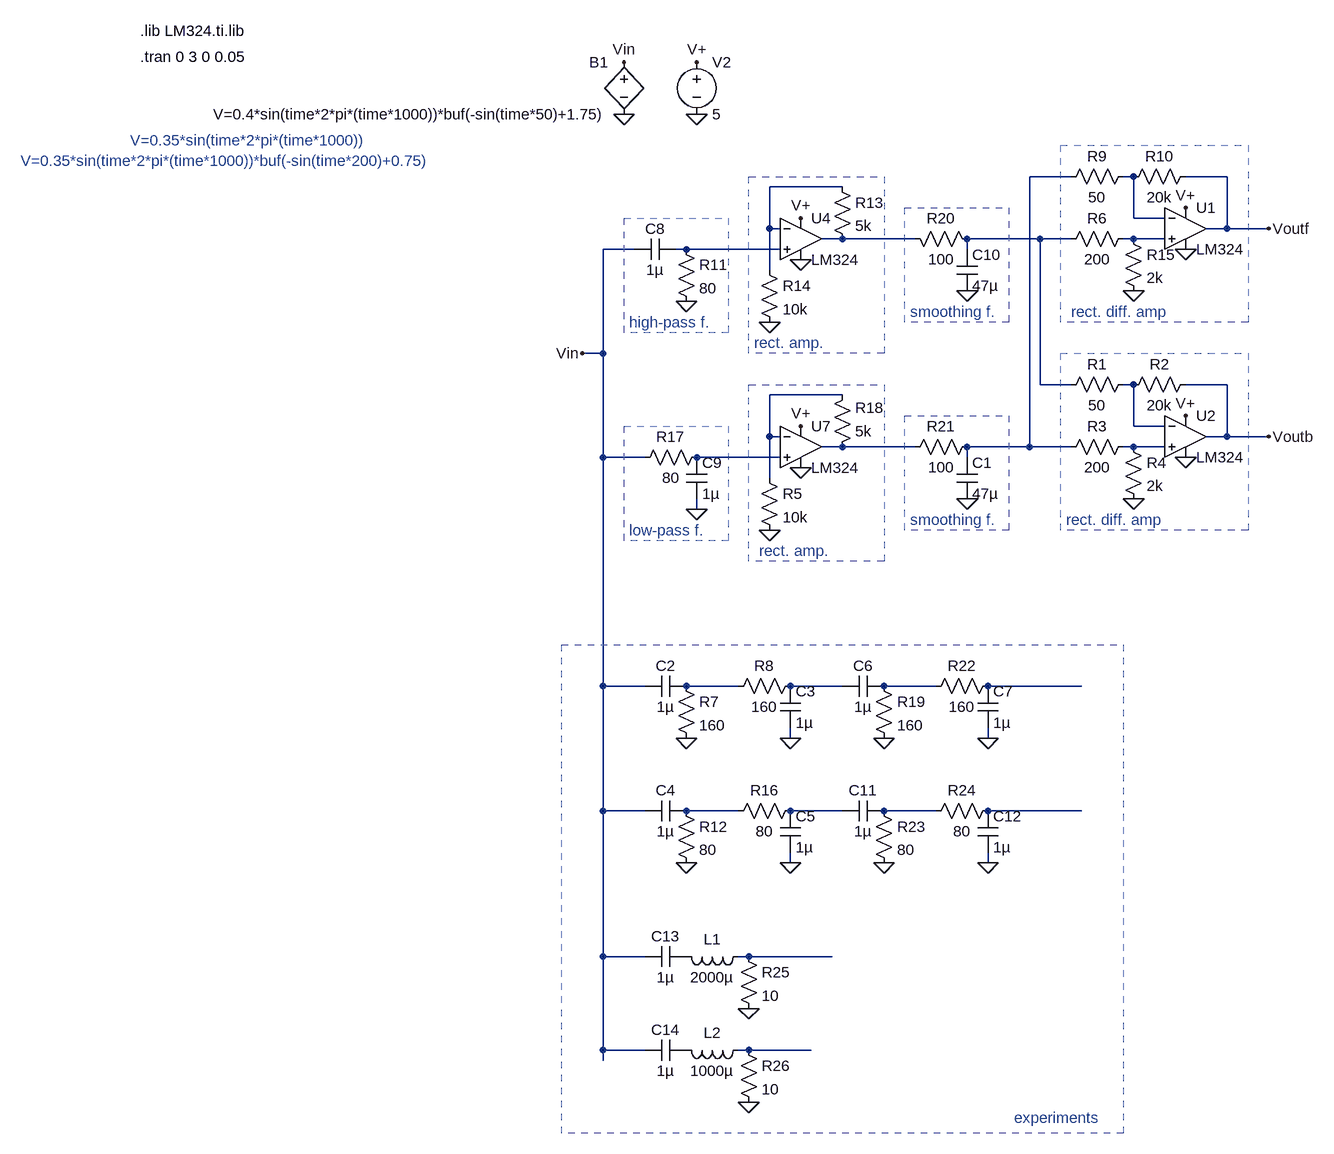
[diagram p0: schematic circuit.asc]
circuit.asc, the LTspice schematic file:
Version 4
SHEET 1 1988 1492
WIRE 352 -48 288 -48
WIRE 448 -48 432 -48
WIRE 592 -48 528 -48
WIRE 0 -32 -112 -32
WIRE 448 16 448 -48
WIRE 496 16 448 16
WIRE -112 32 -112 -32
WIRE -96 32 -112 32
WIRE 592 32 592 -48
WIRE 592 32 560 32
WIRE 656 32 592 32
WIRE 0 48 -32 48
WIRE 112 48 0 48
WIRE 304 48 192 48
WIRE 352 48 304 48
WIRE 448 48 432 48
WIRE 496 48 448 48
WIRE -320 64 -368 64
WIRE -240 64 -256 64
WIRE -96 64 -240 64
WIRE 192 64 192 48
WIRE -112 96 -112 32
WIRE -368 224 -368 64
WIRE -368 224 -400 224
WIRE 304 272 304 48
WIRE 352 272 304 272
WIRE 448 272 432 272
WIRE 592 272 528 272
WIRE 0 288 -112 288
WIRE 448 336 448 272
WIRE 496 336 448 336
WIRE -112 352 -112 288
WIRE -96 352 -112 352
WIRE 592 352 592 272
WIRE 592 352 560 352
WIRE 656 352 592 352
WIRE 0 368 -32 368
WIRE 112 368 0 368
WIRE 288 368 288 -48
WIRE 288 368 192 368
WIRE 352 368 288 368
WIRE 448 368 432 368
WIRE 496 368 448 368
WIRE -368 384 -368 224
WIRE -304 384 -368 384
WIRE -96 384 -224 384
WIRE 192 384 192 368
WIRE -112 416 -112 352
WIRE -224 464 -224 448
WIRE -368 736 -368 384
WIRE -304 736 -368 736
WIRE -160 736 -240 736
WIRE 0 736 -80 736
WIRE 144 736 64 736
WIRE 368 736 224 736
WIRE -80 816 -80 800
WIRE 224 816 224 800
WIRE -368 928 -368 736
WIRE -304 928 -368 928
WIRE -160 928 -240 928
WIRE 0 928 -80 928
WIRE 144 928 64 928
WIRE 368 928 224 928
WIRE -80 1008 -80 992
WIRE 224 1008 224 992
WIRE -368 1152 -368 928
WIRE -304 1152 -368 1152
WIRE -144 1152 -160 1152
WIRE -16 1152 -144 1152
WIRE -368 1296 -368 1152
WIRE -304 1296 -368 1296
WIRE -144 1296 -160 1296
WIRE -48 1296 -144 1296
WIRE -368 1312 -368 1296
FLAG -336 -144 0
FLAG -224 -144 0
FLAG -224 -224 V+
FLAG -240 144 0
FLAG -64 80 0
FLAG -112 176 0
FLAG -64 16 V+
FLAG -224 464 0
FLAG -64 400 0
FLAG -112 496 0
FLAG -64 336 V+
FLAG 192 128 0
FLAG 192 448 0
FLAG 528 64 0
FLAG 528 0 V+
FLAG 656 32 Voutf
FLAG 448 128 0
FLAG 528 384 0
FLAG 528 320 V+
FLAG 656 352 Voutb
FLAG 448 448 0
FLAG -336 -224 Vin
FLAG -400 224 Vin
FLAG -80 816 0
FLAG -240 816 0
FLAG -80 1008 0
FLAG -240 1008 0
FLAG 224 816 0
FLAG 64 816 0
FLAG 224 1008 0
FLAG 64 1008 0
FLAG -144 1232 0
FLAG -144 1376 0
SYMBOL voltage -224 -240 R0
WINDOW 123 0 0 Left 2
WINDOW 39 0 0 Left 2
SYMATTR InstName V2
SYMATTR Value 5
SYMBOL bv -336 -240 M0
SYMATTR InstName B1
SYMATTR Value V=0.4*sin(time*2*pi*(time*1000))*buf(-sin(time*50)+1.75)
SYMBOL res -256 48 R0
SYMATTR InstName R11
SYMATTR Value 80
SYMBOL Opamps\\opamp2 -64 -16 R0
SYMATTR InstName U4
SYMATTR Value LM324
SYMBOL res -16 -48 R0
SYMATTR InstName R13
SYMATTR Value 5k
SYMBOL res -128 80 R0
SYMATTR InstName R14
SYMATTR Value 10k
SYMBOL cap -256 48 R90
WINDOW 0 0 32 VBottom 2
WINDOW 3 32 32 VTop 2
SYMATTR InstName C8
SYMATTR Value 1µ
SYMBOL res -208 368 R90
WINDOW 0 0 56 VBottom 2
WINDOW 3 32 56 VTop 2
SYMATTR InstName R17
SYMATTR Value 80
SYMBOL Opamps\\opamp2 -64 304 R0
SYMATTR InstName U7
SYMATTR Value LM324
SYMBOL res -16 384 M180
WINDOW 0 36 76 Left 2
WINDOW 3 36 40 Left 2
SYMATTR InstName R18
SYMATTR Value 5k
SYMBOL cap -240 384 R0
SYMATTR InstName C9
SYMATTR Value 1µ
SYMBOL res 208 64 M270
WINDOW 0 32 56 VTop 2
WINDOW 3 0 56 VBottom 2
SYMATTR InstName R20
SYMATTR Value 100
SYMBOL cap 176 128 M180
WINDOW 0 24 56 Left 2
WINDOW 3 24 8 Left 2
SYMATTR InstName C10
SYMATTR Value 47µ
SYMBOL res 208 352 R90
WINDOW 0 0 56 VBottom 2
WINDOW 3 32 56 VTop 2
SYMATTR InstName R21
SYMATTR Value 100
SYMBOL res -128 400 R0
SYMATTR InstName R5
SYMATTR Value 10k
SYMBOL Opamps\\opamp2 528 -32 R0
SYMATTR InstName U1
SYMATTR Value LM324
SYMBOL res 448 -64 R90
WINDOW 0 0 56 VBottom 2
WINDOW 3 32 56 VTop 2
SYMATTR InstName R9
SYMATTR Value 50
SYMBOL res 544 -64 R90
WINDOW 0 0 56 VBottom 2
WINDOW 3 32 56 VTop 2
SYMATTR InstName R10
SYMATTR Value 20k
SYMBOL res 432 32 R0
SYMATTR InstName R15
SYMATTR Value 2k
SYMBOL Opamps\\opamp2 528 288 R0
SYMATTR InstName U2
SYMATTR Value LM324
SYMBOL res 448 256 R90
WINDOW 0 0 56 VBottom 2
WINDOW 3 32 56 VTop 2
SYMATTR InstName R1
SYMATTR Value 50
SYMBOL res 544 256 R90
WINDOW 0 0 56 VBottom 2
WINDOW 3 32 56 VTop 2
SYMATTR InstName R2
SYMATTR Value 20k
SYMBOL res 448 352 R90
WINDOW 0 0 56 VBottom 2
WINDOW 3 32 56 VTop 2
SYMATTR InstName R3
SYMATTR Value 200
SYMBOL res 432 352 R0
SYMATTR InstName R4
SYMATTR Value 2k
SYMBOL res 448 32 R90
WINDOW 0 0 56 VBottom 2
WINDOW 3 32 56 VTop 2
SYMATTR InstName R6
SYMATTR Value 200
SYMBOL cap 176 384 R0
SYMATTR InstName C1
SYMATTR Value 47µ
SYMBOL cap -240 720 R90
WINDOW 0 0 32 VBottom 2
WINDOW 3 32 32 VTop 2
SYMATTR InstName C2
SYMATTR Value 1µ
SYMBOL res -256 720 R0
SYMATTR InstName R7
SYMATTR Value 160
SYMBOL res -64 720 R90
WINDOW 0 0 56 VBottom 2
WINDOW 3 32 56 VTop 2
SYMATTR InstName R8
SYMATTR Value 160
SYMBOL cap -96 736 R0
SYMATTR InstName C3
SYMATTR Value 1µ
SYMBOL cap -240 912 R90
WINDOW 0 0 32 VBottom 2
WINDOW 3 32 32 VTop 2
SYMATTR InstName C4
SYMATTR Value 1µ
SYMBOL res -256 912 R0
SYMATTR InstName R12
SYMATTR Value 80
SYMBOL res -64 912 R90
WINDOW 0 0 56 VBottom 2
WINDOW 3 32 56 VTop 2
SYMATTR InstName R16
SYMATTR Value 80
SYMBOL cap -96 928 R0
SYMATTR InstName C5
SYMATTR Value 1µ
SYMBOL cap 64 720 R90
WINDOW 0 0 32 VBottom 2
WINDOW 3 32 32 VTop 2
SYMATTR InstName C6
SYMATTR Value 1µ
SYMBOL res 48 720 R0
SYMATTR InstName R19
SYMATTR Value 160
SYMBOL res 240 720 R90
WINDOW 0 0 56 VBottom 2
WINDOW 3 32 56 VTop 2
SYMATTR InstName R22
SYMATTR Value 160
SYMBOL cap 208 736 R0
SYMATTR InstName C7
SYMATTR Value 1µ
SYMBOL cap 64 912 R90
WINDOW 0 0 32 VBottom 2
WINDOW 3 32 32 VTop 2
SYMATTR InstName C11
SYMATTR Value 1µ
SYMBOL res 48 912 R0
SYMATTR InstName R23
SYMATTR Value 80
SYMBOL res 240 912 R90
WINDOW 0 0 56 VBottom 2
WINDOW 3 32 56 VTop 2
SYMATTR InstName R24
SYMATTR Value 80
SYMBOL cap 208 928 R0
SYMATTR InstName C12
SYMATTR Value 1µ
SYMBOL cap -240 1136 R90
WINDOW 0 0 32 VBottom 2
WINDOW 3 32 32 VTop 2
SYMATTR InstName C13
SYMATTR Value 1µ
SYMBOL ind -144 1136 R90
WINDOW 0 5 56 VBottom 2
WINDOW 3 32 56 VTop 2
SYMATTR InstName L1
SYMATTR Value 2000µ
SYMBOL res -160 1136 R0
SYMATTR InstName R25
SYMATTR Value 10
SYMBOL cap -240 1280 R90
WINDOW 0 0 32 VBottom 2
WINDOW 3 32 32 VTop 2
SYMATTR InstName C14
SYMATTR Value 1µ
SYMBOL ind -144 1280 R90
WINDOW 0 5 56 VBottom 2
WINDOW 3 32 56 VTop 2
SYMATTR InstName L2
SYMATTR Value 1000µ
SYMBOL res -160 1280 R0
SYMATTR InstName R26
SYMATTR Value 10
TEXT -1080 -272 Left 2 !.lib LM324.ti.lib
TEXT -1080 -232 Left 2 !.tran 0 3 0 0.05
TEXT -1096 -104 Left 2 ;V=0.35*sin(time*2*pi*(time*1000))
TEXT -1264 -72 Left 2 ;V=0.35*sin(time*2*pi*(time*1000))*buf(-sin(time*200)+0.75)
TEXT -328 176 Left 2 ;high-pass f.
TEXT -328 496 Left 2 ;low-pass f.
TEXT -136 208 Left 2 ;rect. amp.
TEXT -128 528 Left 2 ;rect. amp.
TEXT 104 160 Left 2 ;smoothing f.
TEXT 104 480 Left 2 ;smoothing f.
TEXT 352 160 Left 2 ;rect. diff. amp
TEXT 344 480 Left 2 ;rect. diff. amp
TEXT 264 1400 Left 2 ;experiments
LINE Normal -336 512 -336 336 2
LINE Normal -176 512 -336 512 2
LINE Normal -176 336 -176 512 2
LINE Normal -336 336 -176 336 2
LINE Normal -336 192 -336 16 2
LINE Normal -176 192 -336 192 2
LINE Normal -176 16 -176 192 2
LINE Normal -336 16 -176 16 2
LINE Normal -144 224 -144 -48 2
LINE Normal 64 224 -144 224 2
LINE Normal 64 -48 64 224 2
LINE Normal -144 -48 64 -48 2
LINE Normal -144 544 -144 272 2
LINE Normal 64 544 -144 544 2
LINE Normal 64 272 64 544 2
LINE Normal -144 272 64 272 2
LINE Normal 96 176 96 0 2
LINE Normal 256 176 96 176 2
LINE Normal 256 0 256 176 2
LINE Normal 96 0 256 0 2
LINE Normal 96 496 96 320 2
LINE Normal 256 496 96 496 2
LINE Normal 256 320 256 496 2
LINE Normal 96 320 256 320 2
LINE Normal 336 176 336 -96 2
LINE Normal 624 176 336 176 2
LINE Normal 624 -96 624 176 2
LINE Normal 336 -96 624 -96 2
LINE Normal 336 496 336 224 2
LINE Normal 624 496 336 496 2
LINE Normal 624 224 624 496 2
LINE Normal 336 224 624 224 2
LINE Normal 432 672 432 1424 2
LINE Normal -432 672 432 672 2
LINE Normal -432 1424 -432 672 2
LINE Normal 432 1424 -432 1424 2
LINE Normal 432 1424 432 1424 2

The netlist it stands for:
* circuit.asc
V2 V+ 0 5
B1 Vin 0 V=0.4*sin(time*2*pi*(time*1000))*buf(-sin(time*50)+1.75)
R11 N007 0 80
XU4 N007 N003 V+ 0 N004 LM324  ; pins In+ In- V+ V- OUT
R13 N003 N004 5k
R14 N003 0 10k
C8 N007 Vin 1µ
R17 N012 Vin 80
XU7 N012 N009 V+ 0 N010 LM324  ; pins In+ In- V+ V- OUT
R18 N010 N009 5k
C9 N012 0 1µ
R20 N005 N004 100
C10 0 N005 47µ
R21 N001 N010 100
R5 N009 0 10k
XU1 N006 N002 V+ 0 Voutf LM324  ; pins In+ In- V+ V- OUT
R9 N002 N001 50
R10 Voutf N002 20k
R15 N006 0 2k
XU2 N011 N008 V+ 0 Voutb LM324  ; pins In+ In- V+ V- OUT
R1 N008 N005 50
R2 Voutb N008 20k
R3 N011 N001 200
R4 N011 0 2k
R6 N006 N005 200
C1 N001 0 47µ
C2 N013 Vin 1µ
R7 N013 0 160
R8 N014 N013 160
C3 N014 0 1µ
C4 N017 Vin 1µ
R12 N017 0 80
R16 N018 N017 80
C5 N018 0 1µ
C6 N015 N014 1µ
R19 N015 0 160
R22 N016 N015 160
C7 N016 0 1µ
C11 N019 N018 1µ
R23 N019 0 80
R24 N020 N019 80
C12 N020 0 1µ
C13 P001 Vin 1µ
L1 N021 P001 2000µ
R25 N021 0 10
C14 P002 Vin 1µ
L2 N022 P002 1000µ
R26 N022 0 10
.lib LM324.ti.lib
.tran 0 3 0 0.05
* V=0.35*sin(time*2*pi*(time*1000))
* V=0.35*sin(time*2*pi*(time*1000))*buf(-sin(time*200)+0.75)
* high-pass f.
* low-pass f.
* rect. amp.
* rect. amp.
* smoothing f.
* smoothing f.
* rect. diff. amp
* rect. diff. amp
* experiments
.backanno
.end